# EAGLE design pcb3 (EAGLE 6.5.0)
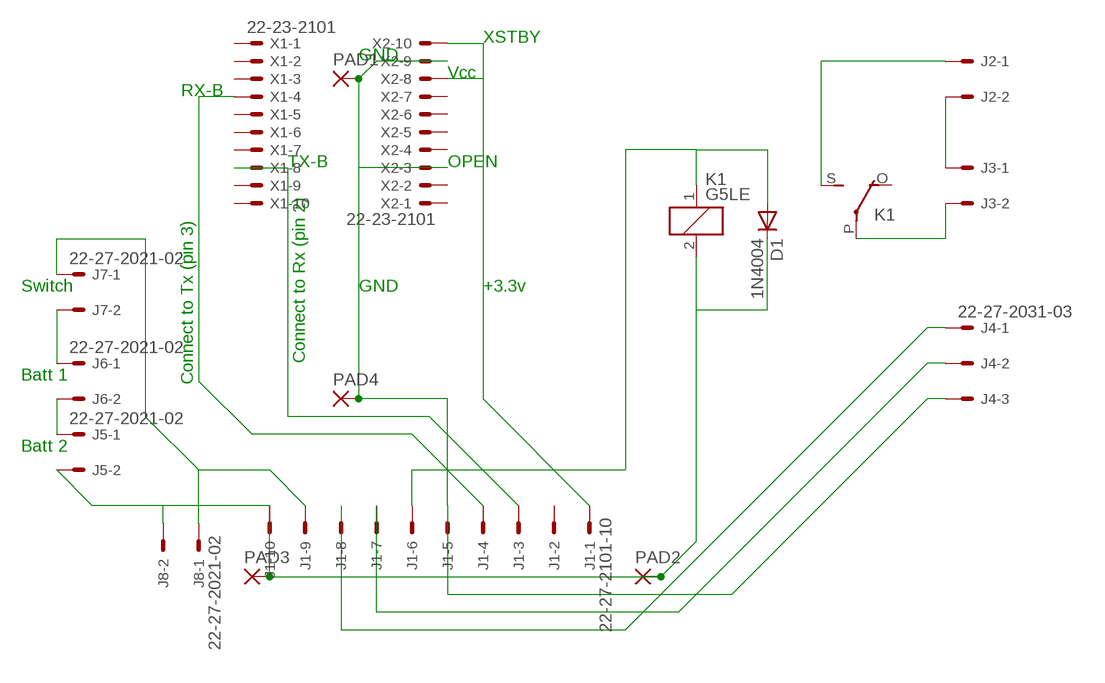
[diagram p0: schematic, sheet 1]

## Parts
D1  1N4004  [DO41-10]
J1  22-27-2101-10  [6410-10]
J2  KK-156-2  [KK-156-2]
J3  KK-156-2  [KK-156-2]
J4  22-27-2031-03  [6410-03]
J5  22-27-2021-02  [6410-02]
J6  22-27-2021-02  [6410-02]
J7  22-27-2021-02  [6410-02]
J8  22-27-2021-02  [6410-02]
K1  G5LE  [G5LE]
PAD1  1,6/0,8  [1,6/0,8]
PAD2  1,6/0,8  [1,6/0,8]
PAD3  1,6/0,8  [1,6/0,8]
PAD4  1,6/0,8  [1,6/0,8]
X1  22-23-2101  [22-23-2101]
X2  22-23-2101  [22-23-2101]

## Nets
N$1: J1.1 X2.8 X2.10
N$2: J1.9 J7.1 J8.1
N$3: J1.4 X1.4
N$4: J1.3 X1.8
N$5: J1.5 J4.3 PAD1.1(P) PAD4.1(P) X2.3 X2.9
N$6: D1.A J1.6 K1.1
N$7: J2.2 J3.1
N$8: J3.2 K1.P(2:P)
N$9: J2.1 K1.S(2:S)
N$11: J1.7 J4.2
N$12: J1.8 J4.1
N$13: J5.1 J6.2
N$14: J6.1 J7.2
N$15: D1.C J1.10 J5.2 J8.2 K1.2 PAD2.1(P) PAD3.1(P)
Unconnected: J1.2 K1.O(2:O) X1.1 X1.2 X1.3 X1.5 X1.6 X1.7 X1.9 X1.10 X2.1 X2.2 X2.4 X2.5 X2.6 X2.7

## Notes on the sheet
- XSTBY
- GND
- Vcc
- RX-B
- TX-B | OPEN
- Connect to Tx (pin 3)
- Switch | GND | +3.3v
- Connect to Rx (pin 2)
- Batt 1
- Batt 2

## Library data of the parts
D1 = diode:1N4004: DIODE general purpose rectifier, 1 A
J1 = con-molex:22-?-10: CONNECTOR wire to board 2.54 mm (.1 inch) pitch header; OC_FARNELL: unknown; OC_NEWARK: unknown
J2 J3 = con-molex:KK-156-2: KK 156 HEADER Source: http://www.molex.com/pdm_docs/sd/026604100_sd.pdf; OC_FARNELL: unknown; OC_NEWARK: unknown
J4 = con-molex:22-?-03: CONNECTOR wire to board 2.54 mm (.1 inch) pitch header; OC_FARNELL: unknown; OC_NEWARK: unknown
J5-J8 = con-molex:22-?-02: CONNECTOR wire to board 2.54 mm (.1 inch) pitch header; OC_FARNELL: unknown; OC_NEWARK: unknown
K1 = relay:G5LE: RELAY 1 x switch, 10 A/120 V AC, 8 A/30 V DC, Omron; OC_FARNELL: unknown; OC_NEWARK: unknown
PAD1-PAD4 = wirepad:1,6/0,8: THROUGH-HOLE PAD
X1 X2 = con-molex:22-23-2101: .100" (2.54mm) Center Header - 10 Pin; MF: MOLEX; MPN: 22-23-2101; OC_FARNELL: 1756828; OC_NEWARK: 94C0765

## Board
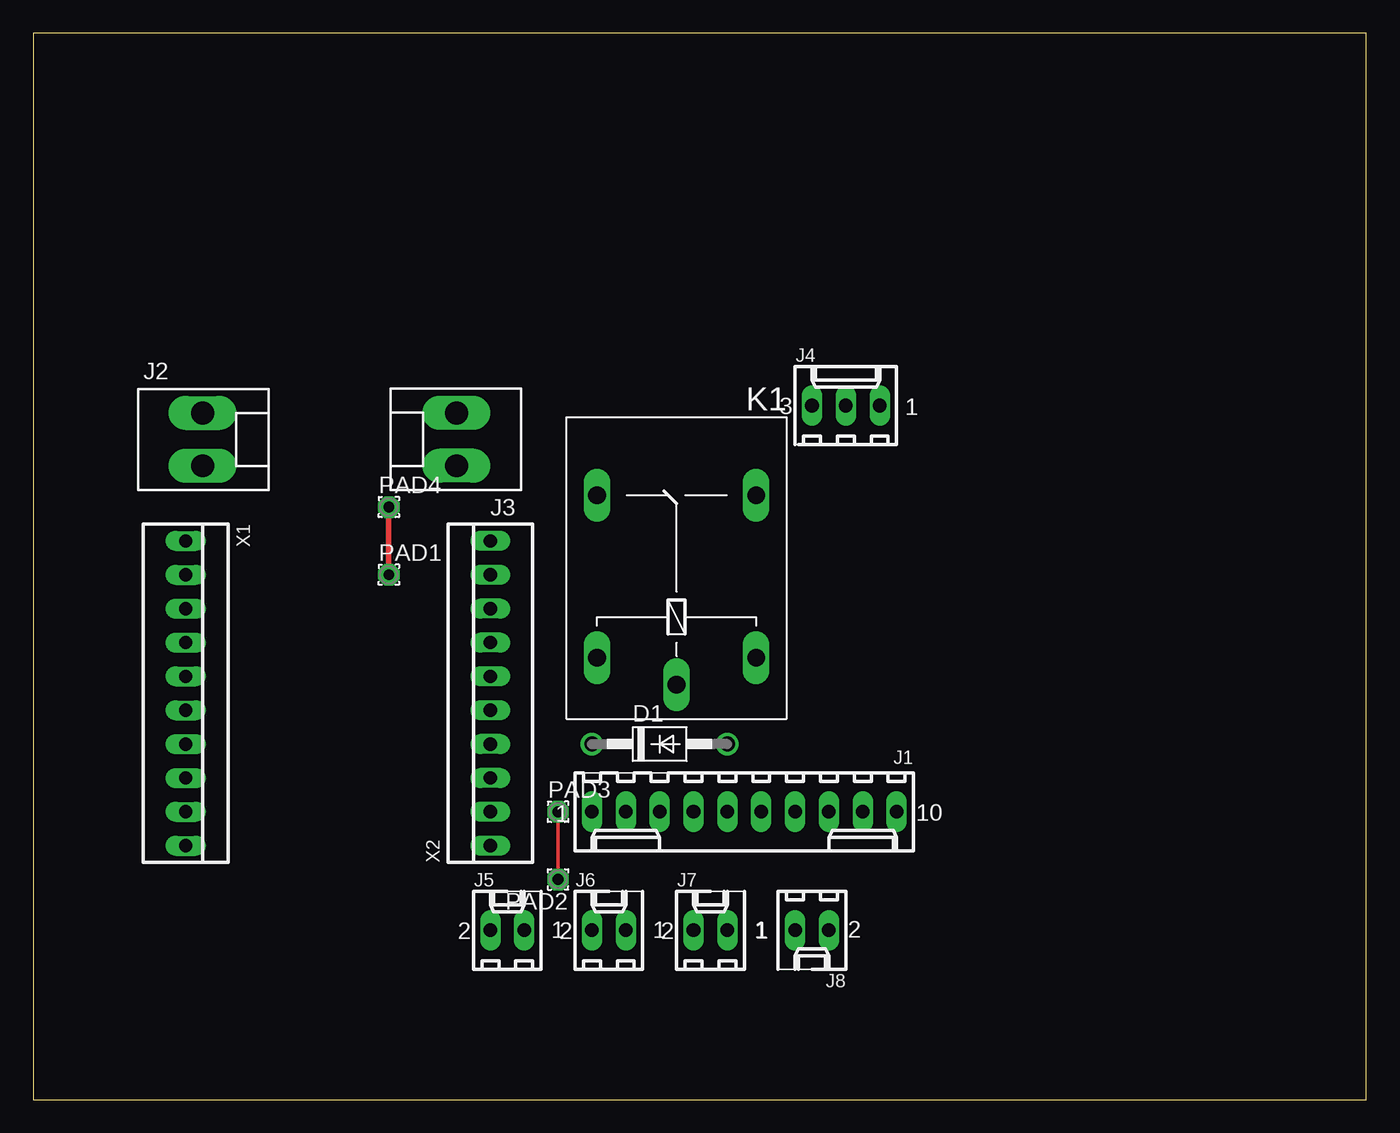
[diagram p1: board, top side]
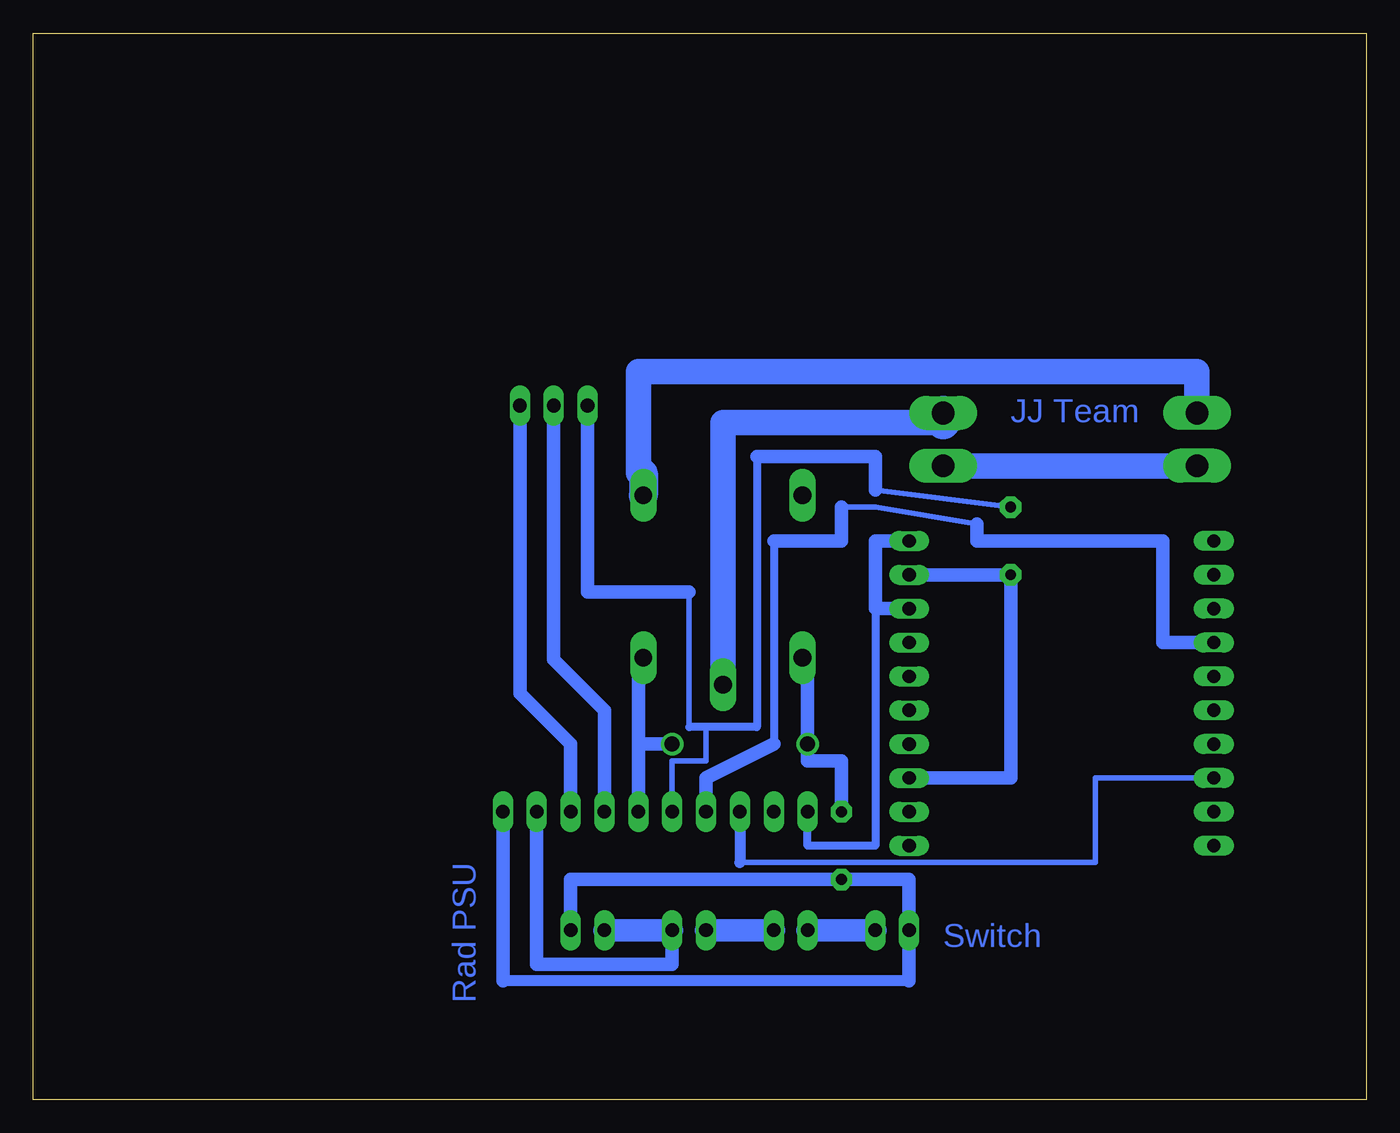
[diagram p2: board, bottom side, seen from below]

Size 100 x 80 mm. Coordinates in mm from the lower left corner, seen from the top.
Outline: 0,0 100,0 100,80 0,80 0,0
Copper layers (1*16): Top 0.035mm / dielectric 1.5mm / Bottom 0.035mm
Design rules "default": minimum track width 10mil, minimum drill 24mil, track to track 8mil, track to pad 8mil, pad to pad 8mil, via to via 8mil, smd to smd 8mil, copper to edge 40mil, drill to drill 8mil, minimum pad ring 10mil, minimum via ring 8mil, stop-mask expansion 4mil, vias tented up to drill 0mil, thermal gap 10mil

### Footprints (pad centres in the part's own frame; a part is rotated, then mirrored left to right if it is on the bottom)
DO41-10 = drill 1.118: A 5.08,0; C -5.08,0
6410-10 = drill 1.016 long: 1 11.43,0; 2 8.89,0; 3 6.35,0; 4 3.81,0; 5 1.27,0; 6 -1.27,0; 7 -3.81,0; 8 -6.35,0; 9 -8.89,0; 10 -11.43,0
KK-156-2 = drill 1.7 pad 2.184 long: 1 -1.98,0; 2 1.98,0
6410-03 = drill 1.016 long: 1 2.54,0; 2 0,0; 3 -2.54,0
6410-02 = drill 1.016 long: 1 1.27,0; 2 -1.27,0
G5LE = drill 1.321 long: 1 -7.493,-5.969; 2 -7.493,5.969; O 4.699,5.969; P -9.525,0; S 4.699,-5.969
1,6/0,8 = drill 0.813 pad 1.6 octagon: 1 0,0
22-23-2101 = drill 1 long: 1 -11.43,0; 2 -8.89,0; 3 -6.35,0; 4 -3.81,0; 5 -1.27,0; 6 1.27,0; 7 3.81,0; 8 6.35,0; 9 8.89,0; 10 11.43,0

### Placement (x,y rotation side)
D1  46.99,26.67 0 top
J1  53.34,21.59 180 top
J2  12.7,49.53 270 top
J3  31.75,49.53 90 top
J4  60.96,52.07 0 top
J5  35.56,12.7 0 top
J6  43.18,12.7 0 top
J7  50.8,12.7 0 top
J8  58.42,12.7 180 top
K1  48.26,40.64 90 top
PAD1  26.67,39.37 0 top
PAD2  39.37,16.51 180 top
PAD3  39.37,21.59 0 top
PAD4  26.67,44.45 0 top
X1  11.43,30.48 270 top
X2  34.29,30.48 90 top

### Tracks (layer width: path | path; a pad name or v marks a point on that pad's centre or on a via)
N$1
  Bottom 0.61: J1.1 41.91,19.05 36.83,19.05 36.83,36.83
  Bottom 1.016: X2.8 36.83,36.83 36.83,41.91 X2.10
N$2
  Bottom 1.016: J1.9 62.23,10.16 52.07,10.16 J7.1
  Bottom 1.676: J7.1 J8.1
N$3
  Bottom 0.406: 29.21,43.18 36.83,44.45 39.37,44.45
  Bottom 0.61: 44.45,41.91 44.45,26.67
  Bottom 1.016: X1.4 15.24,34.29 15.24,41.91 29.21,41.91 29.21,43.18 | 39.37,44.45 39.37,41.91 44.45,41.91 | 44.45,26.67 49.53,24.13 J1.4
N$4
  Bottom 0.406: X1.8 20.32,24.13 20.32,17.78 46.99,17.78
  Bottom 0.813: J1.3 46.99,17.78
N$5
  Top 0.406: PAD1.1 PAD4.1
  Bottom 0.406: J1.5 52.07,25.4 49.53,25.4 49.53,27.94 50.8,27.94 50.8,38.1 | PAD4.1 36.83,45.72
  Bottom 0.61: 45.72,48.26 45.72,27.94 50.8,27.94
  Bottom 1.016: X2.9 PAD1.1 26.67,24.13 X2.3 | 36.83,45.72 36.83,48.26 45.72,48.26 | 50.8,38.1 58.42,38.1 J4.3
N$6
  Bottom 1.016: K1.1 54.48,33.15 54.61,33.02 54.61,26.67 | J1.6 54.61,26.67 | 54.61,26.67 D1.A
N$7
  Bottom 1.93: J2.2 J3.1
N$8
  Bottom 1.93: K1.P 48.26,50.8 31.75,50.8
  Bottom 2.54: 31.75,50.8 J3.2
N$9
  Bottom 1.016: 54.61,46.99 54.23,46.99
  Bottom 1.93: J2.1 12.7,54.61 54.61,54.61 54.61,46.99
  Bottom 2.184: 54.23,46.99 K1.S
N$11
  Bottom 1.016: J1.7 57.15,29.21 60.96,33.02 J4.2
N$12
  Bottom 1.016: J4.1 63.5,30.48 59.69,26.67 J1.8
N$13
  Bottom 1.676: J5.1 J6.2
N$14
  Bottom 1.676: J6.1 J7.2
N$15
  Top 0.254: PAD2.1 PAD3.1
  Bottom 0.254: 41.91,33.02 K1.2
  Bottom 0.813: 34.29,8.89 64.77,8.89
  Bottom 1.016: 34.29,8.89 J5.2 34.29,16.51 PAD2.1 59.69,16.51 J8.2 | 64.77,8.89 J1.10 | PAD3.1 39.37,25.4 41.91,25.4 D1.C 41.91,33.02

### Text on the board
Bottom: JJ Team | Rad PSU | Switch